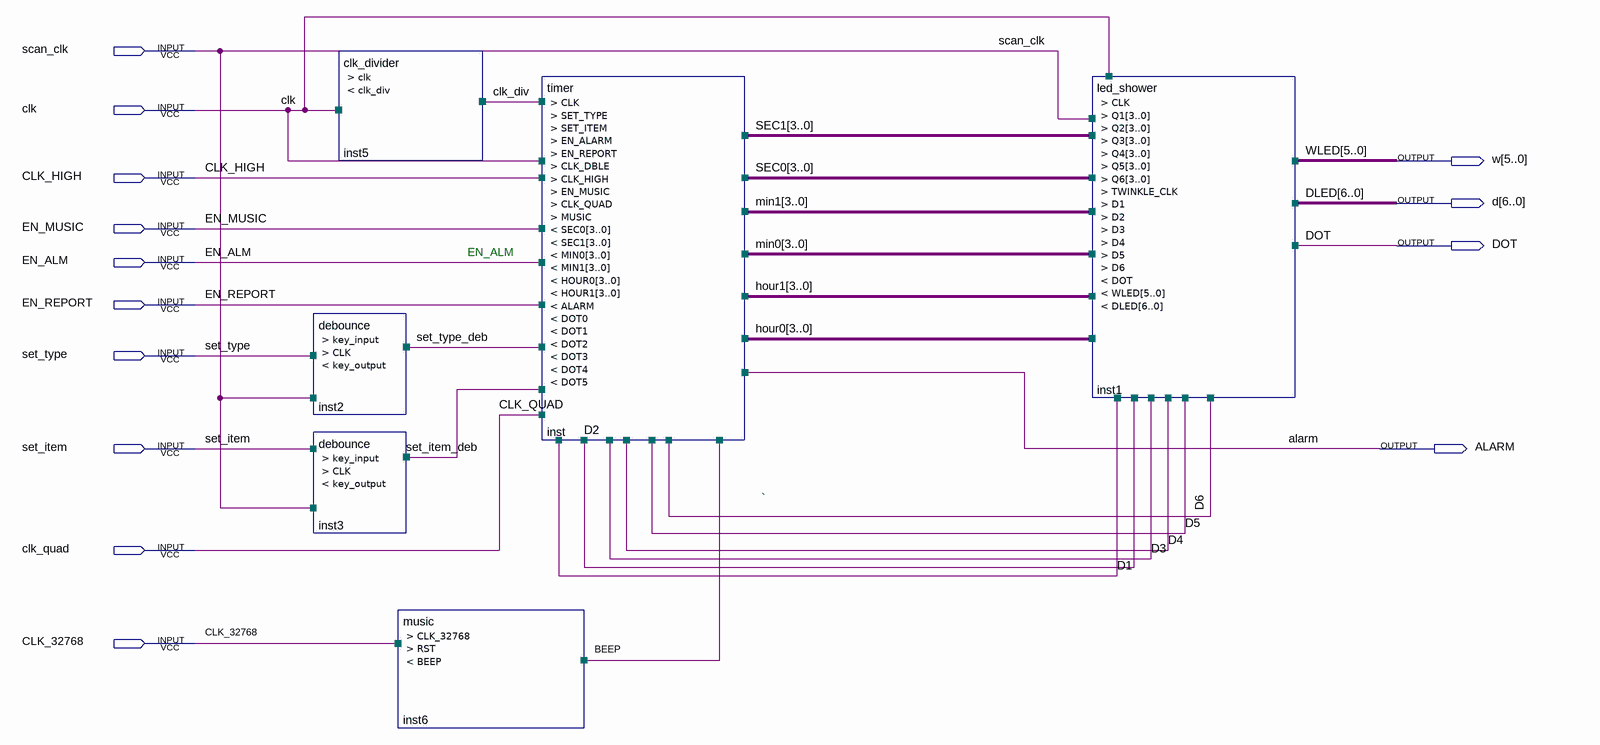
[diagram p0: schematic sheet]
// Quartus schematic digital_clock.bdf as structural Verilog: 6 symbols, 14 pins
module digital_clock (
  input  scan_clk,
  input  clk,
  input  CLK_HIGH,
  input  EN_MUSIC,
  input  EN_ALM,
  input  EN_REPORT,
  input  set_type,
  input  set_item,
  input  clk_quad,
  input  CLK_32768,
  output [5:0] w,
  output [6:0] d,
  output DOT,
  output ALARM
);

  wire BEEP, clk_div, set_item_deb, set_type_deb;
  wire [3:0] hour0, hour1, min0, min1, SEC0, SEC1;

  clk_divider inst5 (.clk(clk), .clk_div(clk_div));
  debounce inst2 (.key_input(set_type), .CLK(scan_clk), .key_output(set_type_deb));
  debounce inst3 (.key_input(set_item), .CLK(scan_clk), .key_output(set_item_deb));
  music inst6 (.CLK_32768(CLK_32768), .BEEP(BEEP));  // open: RST
  timer inst (
    .CLK(clk_div), .SET_TYPE(set_type_deb), .SET_ITEM(set_item_deb), .EN_ALARM(EN_ALM),
    .EN_REPORT(EN_REPORT), .CLK_DBLE(clk), .CLK_HIGH(CLK_HIGH), .EN_MUSIC(EN_MUSIC), .CLK_QUAD(clk_quad),
    .MUSIC(BEEP), .SEC0(SEC0), .SEC1(SEC1), .MIN0(min0), .MIN1(min1), .HOUR0(hour0), .HOUR1(hour1),
    .ALARM(ALARM), .DOT0(d[1]), .DOT1(d[2]), .DOT2(d[3]), .DOT3(d[4]), .DOT4(d[5]), .DOT5(d[6]));
  led_shower inst1 (
    .CLK(scan_clk), .Q1(SEC0), .Q2(SEC1), .Q3(min0), .Q4(min1), .Q5(hour0), .Q6(hour1), .TWINKLE_CLK(clk),
    .D1(d[1]), .D2(d[2]), .D3(d[3]), .D4(d[4]), .D5(d[5]), .D6(d[6]), .DOT(DOT), .WLED(w), .DLED(d));

  // Other names for the same wires on the sheet: DLED[6:0] = d; WLED[5:0] = w

  // Notes on the sheet:
  //   EN_ALM
  //   `
endmodule
